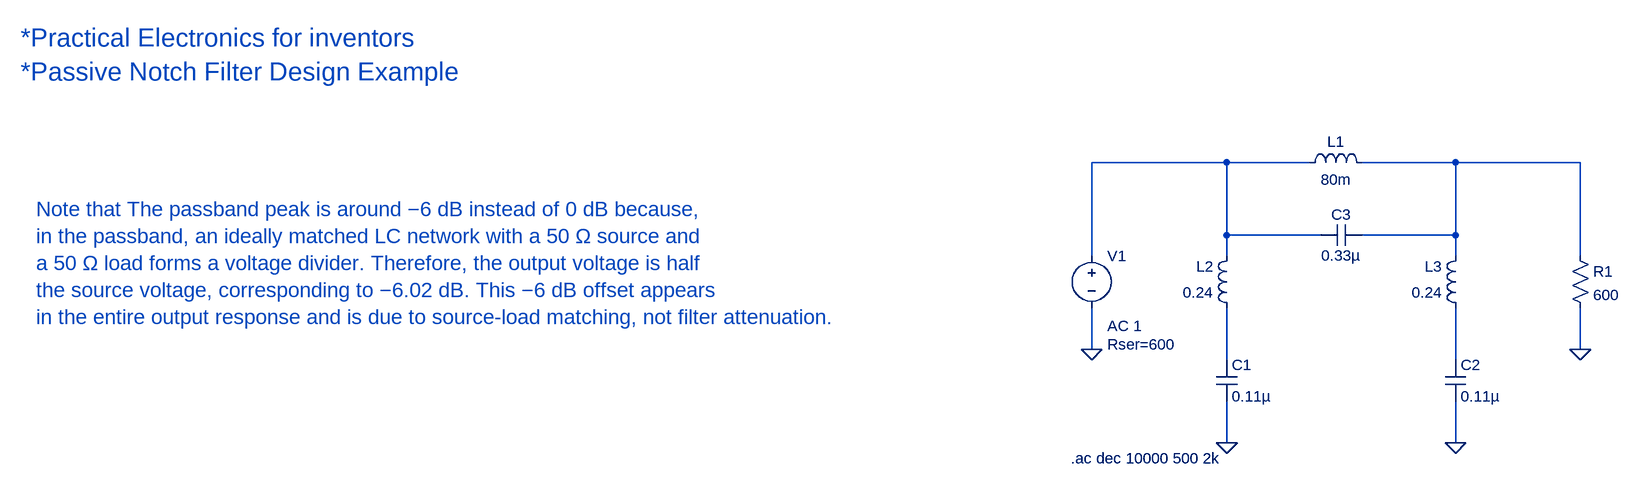
[diagram p0: schematic Filters - Passive LC Notch Filter - 3rd order.asc]
Filters - Passive LC Notch Filter - 3rd order.asc, the LTspice schematic file:
Version 4.1
SHEET 1 880 680
WIRE 48 0 -160 0
WIRE 176 0 48 0
WIRE 400 0 256 0
WIRE 592 0 400 0
WIRE 48 112 48 0
WIRE 192 112 48 112
WIRE 400 112 400 0
WIRE 400 112 256 112
WIRE -160 144 -160 0
WIRE 48 144 48 112
WIRE 400 144 400 112
WIRE 592 144 592 0
WIRE -160 288 -160 224
WIRE 592 288 592 224
WIRE 48 304 48 224
WIRE 400 304 400 224
WIRE 48 432 48 368
WIRE 400 432 400 368
FLAG 48 432 0
FLAG 400 432 0
FLAG 592 288 0
FLAG -160 288 0
SYMBOL voltage -160 128 R0
WINDOW 123 24 124 Left 2
WINDOW 39 24 152 Left 2
SYMATTR InstName V1
SYMATTR Value ""
SYMATTR Value2 AC 1
SYMATTR SpiceLine Rser=600
SYMBOL res 576 128 R0
SYMATTR InstName R1
SYMATTR Value 600
SYMBOL ind 160 16 R270
WINDOW 0 32 56 VTop 2
WINDOW 3 5 56 VBottom 2
SYMATTR InstName L1
SYMATTR Value 80m
SYMATTR SpiceLine Rser=1m
SYMBOL ind 64 240 R180
WINDOW 0 36 80 Left 2
WINDOW 3 36 40 Left 2
SYMATTR InstName L2
SYMATTR Value 0.24
SYMATTR SpiceLine Rser=1m
SYMBOL ind 416 240 R180
WINDOW 0 36 80 Left 2
WINDOW 3 36 40 Left 2
SYMATTR InstName L3
SYMATTR Value 0.24
SYMATTR SpiceLine Rser=1m
SYMBOL cap 32 304 R0
SYMATTR InstName C1
SYMATTR Value 0.11µ
SYMBOL cap 384 304 R0
SYMATTR InstName C2
SYMATTR Value 0.11µ
SYMBOL cap 256 96 R90
WINDOW 0 0 32 VBottom 2
WINDOW 3 32 32 VTop 2
SYMATTR InstName C3
SYMATTR Value 0.33µ
TEXT -192 456 Left 2 !.ac dec 10000 500 2k
TEXT -1784 72 Left 3 ;Note that The passband peak is around −6 dB instead of 0 dB because,\nin the passband, an ideally matched LC network with a 50 Ω source and\na 50 Ω load forms a voltage divider. Therefore, the output voltage is half\nthe source voltage, corresponding to −6.02 dB. This −6 dB offset appears \nin the entire output response and is due to source-load matching, not filter attenuation.
TEXT -1808 -192 Left 4 ;*Practical Electronics for inventors\n*Passive Notch Filter Design Example

The netlist it stands for:
* Filters - Passive LC Notch Filter - 3rd order.asc
V1 N001 0 AC 1 Rser=600
R1 N002 0 600
L1 N001 N002 80m Rser=1m
L2 N003 N001 0.24 Rser=1m
L3 N004 N002 0.24 Rser=1m
C1 N003 0 0.11µ
C2 N004 0 0.11µ
C3 N002 N001 0.33µ
.ac dec 10000 500 2k
* Note that The passband peak is around −6 dB instead of 0 dB because,
* in the passband, an ideally matched LC network with a 50 Ω source and
* a 50 Ω load forms a voltage divider. Therefore, the output voltage is half
* the source voltage, corresponding to −6.02 dB. This −6 dB offset appears
* in the entire output response and is due to source-load matching, not filter attenuation.
* *Practical Electronics for inventors
* *Passive Notch Filter Design Example
.backanno
.end